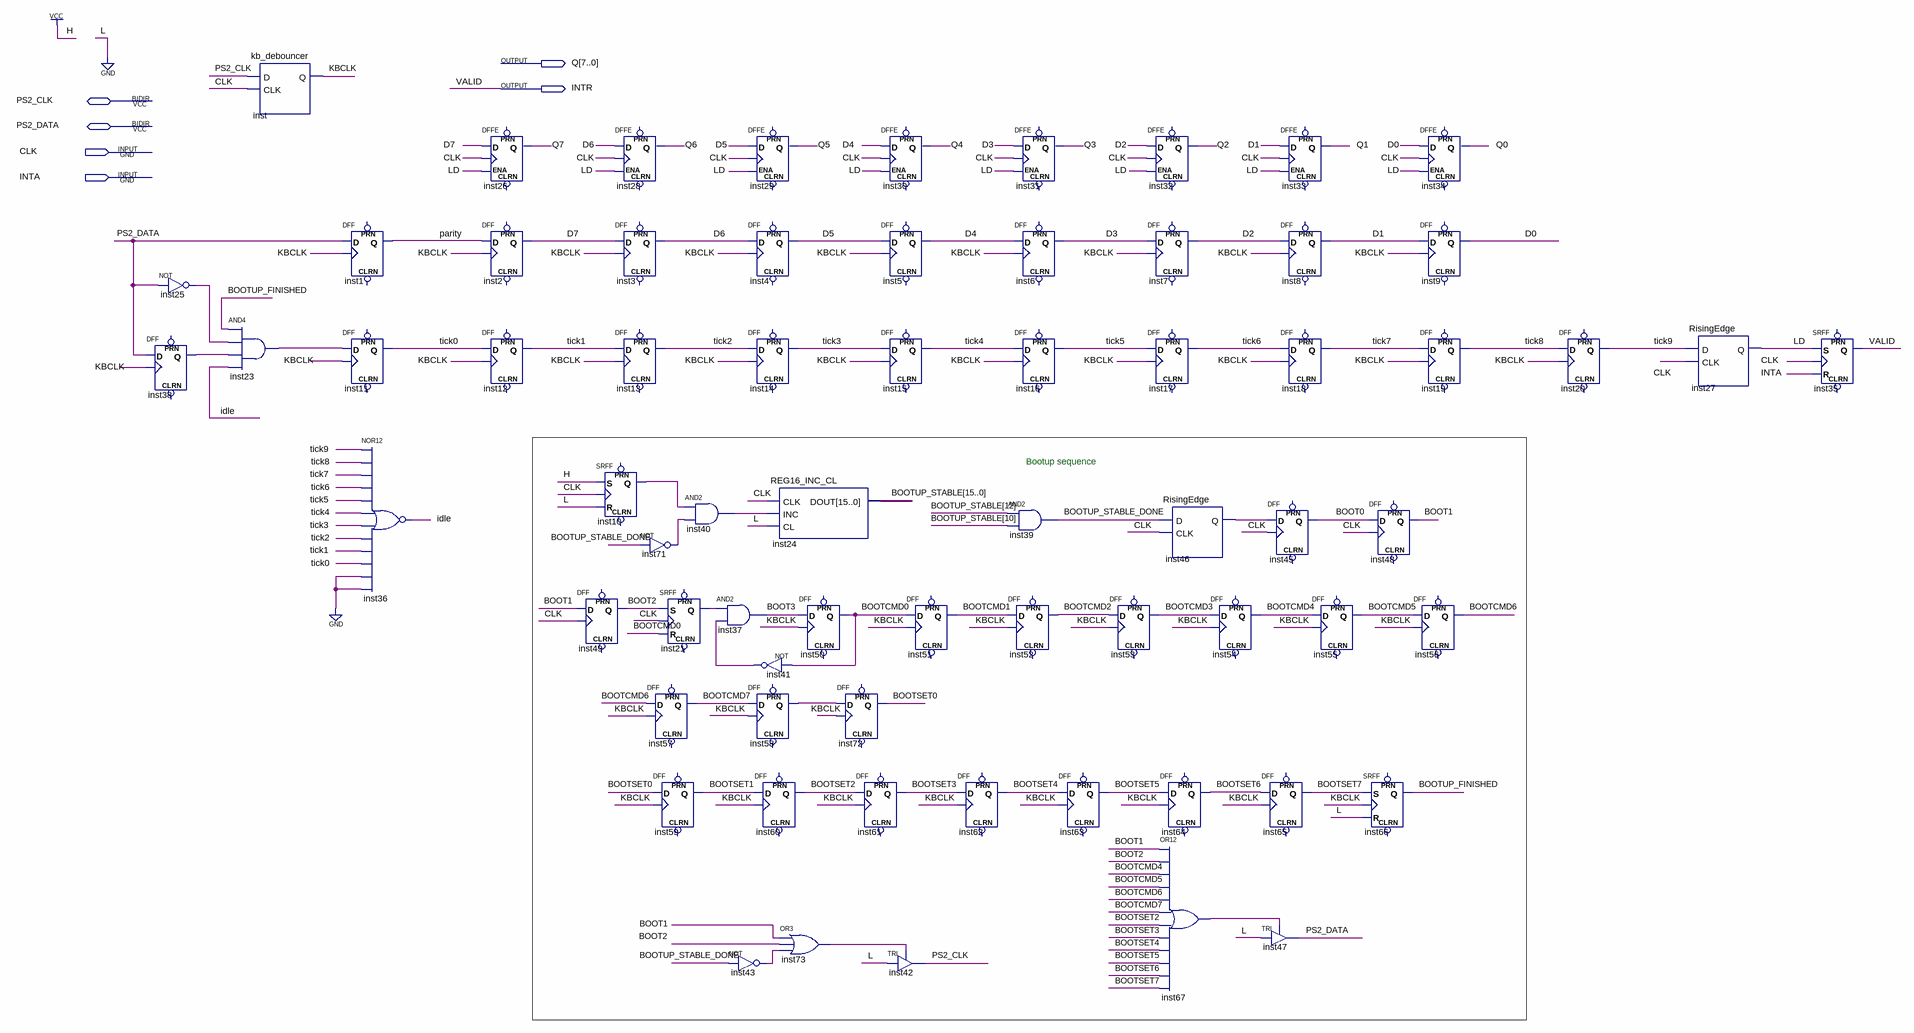
[diagram p0: schematic sheet]
// Quartus schematic kb_controller-set3-wip.bdf as structural Verilog: 69 symbols, 6 pins
module \kb_controller-set3-wip  (
  input  CLK,
  input  INTA,
  inout  PS2_CLK,
  inout  PS2_DATA,
  output [7:0] Q,
  output INTR
);

  wire BOOT0, BOOT1, BOOT2, BOOT3, BOOTCMD0, BOOTCMD1, BOOTCMD2, BOOTCMD3, BOOTCMD4, BOOTCMD5, BOOTCMD6,
       BOOTCMD7, BOOTSET0, BOOTSET1, BOOTSET2, BOOTSET3, BOOTSET4, BOOTSET5, BOOTSET6, BOOTSET7,
       BOOTUP_FINISHED, BOOTUP_STABLE_DONE, D0, D1, D2, D3, D4, D5, D6, D7, idle, inst10_q, inst21_q,
       inst23_out, inst25_out, inst38_q, inst40_out, inst41_out, inst43_out, inst46_q, inst58_q, inst67_out,
       inst71_out, inst73_out, KBCLK, LD, parity, tick0, tick1, tick2, tick3, tick4, tick5, tick6, tick7,
       tick8, tick9;
  wire [15:0] BOOTUP_STABLE;

  not inst25 (inst25_out, PS2_DATA);
  DFF inst38 (.CLK(KBCLK), .D(PS2_DATA), .Q(inst38_q));  // open: CLRN, PRN
  kb_debouncer inst (.D(PS2_CLK), .CLK(CLK), .Q(KBCLK));
  and inst23 (inst23_out, BOOTUP_FINISHED, inst25_out, inst38_q, idle);
  DFF inst1 (.CLK(KBCLK), .D(PS2_DATA), .Q(parity));  // open: CLRN, PRN
  DFF inst11 (.CLK(KBCLK), .D(inst23_out), .Q(tick0));  // open: CLRN, PRN
  nor inst36 (idle, tick9, tick8, tick7, tick6, tick5, tick4, tick3, tick2, tick1, tick0, 1'b0, 1'b0);
  DFFE inst26 (.D(D7), .CLK(CLK), .ENA(LD), .Q(Q[7]));  // open: PRN, CLRN
  DFF inst2 (.CLK(KBCLK), .D(parity), .Q(D7));  // open: CLRN, PRN
  DFF inst12 (.CLK(KBCLK), .D(tick0), .Q(tick1));  // open: CLRN, PRN
  DFF inst49 (.CLK(CLK), .D(BOOT1), .Q(BOOT2));  // open: CLRN, PRN
  DFFE inst28 (.D(D6), .CLK(CLK), .ENA(LD), .Q(Q[6]));  // open: PRN, CLRN
  DFF inst3 (.CLK(KBCLK), .D(D7), .Q(D6));  // open: CLRN, PRN
  DFF inst13 (.CLK(KBCLK), .D(tick1), .Q(tick2));  // open: CLRN, PRN
  SRFF inst10 (.S(1'b1), .R(1'b0), .CLK(CLK), .Q(inst10_q));  // open: PRN, CLRN
  not inst71 (inst71_out, BOOTUP_STABLE_DONE);
  SRFF inst21 (.S(BOOT2), .R(BOOTCMD0), .CLK(CLK), .Q(inst21_q));  // open: PRN, CLRN
  DFF inst57 (.CLK(KBCLK), .D(BOOTCMD6), .Q(BOOTCMD7));  // open: CLRN, PRN
  DFF inst59 (.CLK(KBCLK), .D(BOOTSET0), .Q(BOOTSET1));  // open: CLRN, PRN
  and inst40 (inst40_out, inst10_q, inst71_out);
  and inst37 (BOOT3, inst21_q, inst41_out);
  not inst43 (inst43_out, BOOTUP_STABLE_DONE);
  DFFE inst29 (.D(D5), .CLK(CLK), .ENA(LD), .Q(Q[5]));  // open: PRN, CLRN
  DFF inst4 (.CLK(KBCLK), .D(D6), .Q(D5));  // open: CLRN, PRN
  DFF inst14 (.CLK(KBCLK), .D(tick2), .Q(tick3));  // open: CLRN, PRN
  REG16_INC_CL inst24 (.CLK(CLK), .INC(inst40_out), .CL(1'b0), .DOUT(BOOTUP_STABLE));
  not inst41 (inst41_out, BOOTCMD0);
  DFF inst58 (.CLK(KBCLK), .D(BOOTCMD7), .Q(inst58_q));  // open: CLRN, PRN
  DFF inst60 (.CLK(KBCLK), .D(BOOTSET1), .Q(BOOTSET2));  // open: CLRN, PRN
  or inst73 (inst73_out, BOOT1, BOOT2, inst43_out);
  DFF inst50 (.CLK(KBCLK), .D(BOOT3), .Q(BOOTCMD0));  // open: CLRN, PRN
  DFFE inst30 (.D(D4), .CLK(CLK), .ENA(LD), .Q(Q[4]));  // open: PRN, CLRN
  DFF inst5 (.CLK(KBCLK), .D(D5), .Q(D4));  // open: CLRN, PRN
  DFF inst15 (.CLK(KBCLK), .D(tick3), .Q(tick4));  // open: CLRN, PRN
  DFF inst72 (.CLK(KBCLK), .D(inst58_q), .Q(BOOTSET0));  // open: CLRN, PRN
  DFF inst61 (.CLK(KBCLK), .D(BOOTSET2), .Q(BOOTSET3));  // open: CLRN, PRN
  DFF inst51 (.CLK(KBCLK), .D(BOOTCMD0), .Q(BOOTCMD1));  // open: CLRN, PRN
  TRI inst42 (.IN(1'b0), .OE(inst73_out), .OUT(PS2_CLK));
  DFF inst62 (.CLK(KBCLK), .D(BOOTSET3), .Q(BOOTSET4));  // open: CLRN, PRN
  DFFE inst31 (.D(D3), .CLK(CLK), .ENA(LD), .Q(Q[3]));  // open: PRN, CLRN
  DFF inst6 (.CLK(KBCLK), .D(D4), .Q(D3));  // open: CLRN, PRN
  DFF inst16 (.CLK(KBCLK), .D(tick4), .Q(tick5));  // open: CLRN, PRN
  and inst39 (BOOTUP_STABLE_DONE, BOOTUP_STABLE[12], BOOTUP_STABLE[10]);
  DFF inst52 (.CLK(KBCLK), .D(BOOTCMD1), .Q(BOOTCMD2));  // open: CLRN, PRN
  DFF inst63 (.CLK(KBCLK), .D(BOOTSET4), .Q(BOOTSET5));  // open: CLRN, PRN
  DFF inst53 (.CLK(KBCLK), .D(BOOTCMD2), .Q(BOOTCMD3));  // open: CLRN, PRN
  DFFE inst32 (.D(D2), .CLK(CLK), .ENA(LD), .Q(Q[2]));  // open: PRN, CLRN
  DFF inst7 (.CLK(KBCLK), .D(D3), .Q(D2));  // open: CLRN, PRN
  DFF inst17 (.CLK(KBCLK), .D(tick5), .Q(tick6));  // open: CLRN, PRN
  RisingEdge inst46 (.D(BOOTUP_STABLE_DONE), .CLK(CLK), .Q(inst46_q));
  DFF inst64 (.CLK(KBCLK), .D(BOOTSET5), .Q(BOOTSET6));  // open: CLRN, PRN
  or inst67 (inst67_out, BOOT1, BOOT2, BOOTCMD4, BOOTCMD5, BOOTCMD6, BOOTCMD7, BOOTSET2, BOOTSET3, BOOTSET4, BOOTSET5, BOOTSET6, BOOTSET7);
  DFF inst54 (.CLK(KBCLK), .D(BOOTCMD3), .Q(BOOTCMD4));  // open: CLRN, PRN
  DFFE inst33 (.D(D1), .CLK(CLK), .ENA(LD), .Q(Q[1]));  // open: PRN, CLRN
  DFF inst8 (.CLK(KBCLK), .D(D2), .Q(D1));  // open: CLRN, PRN
  DFF inst18 (.CLK(KBCLK), .D(tick6), .Q(tick7));  // open: CLRN, PRN
  DFF inst45 (.CLK(CLK), .D(inst46_q), .Q(BOOT0));  // open: CLRN, PRN
  DFF inst65 (.CLK(KBCLK), .D(BOOTSET6), .Q(BOOTSET7));  // open: CLRN, PRN
  TRI inst47 (.IN(1'b0), .OE(inst67_out), .OUT(PS2_DATA));
  DFF inst55 (.CLK(KBCLK), .D(BOOTCMD4), .Q(BOOTCMD5));  // open: CLRN, PRN
  DFF inst48 (.CLK(CLK), .D(BOOT0), .Q(BOOT1));  // open: CLRN, PRN
  SRFF inst66 (.S(BOOTSET7), .R(1'b0), .CLK(KBCLK), .Q(BOOTUP_FINISHED));  // open: PRN, CLRN
  DFFE inst34 (.D(D0), .CLK(CLK), .ENA(LD), .Q(Q[0]));  // open: PRN, CLRN
  DFF inst9 (.CLK(KBCLK), .D(D1), .Q(D0));  // open: CLRN, PRN
  DFF inst19 (.CLK(KBCLK), .D(tick7), .Q(tick8));  // open: CLRN, PRN
  DFF inst56 (.CLK(KBCLK), .D(BOOTCMD5), .Q(BOOTCMD6));  // open: CLRN, PRN
  DFF inst20 (.CLK(KBCLK), .D(tick8), .Q(tick9));  // open: CLRN, PRN
  RisingEdge inst27 (.D(tick9), .CLK(CLK), .Q(LD));
  SRFF inst35 (.S(LD), .R(INTA), .CLK(CLK), .Q(INTR));  // open: PRN, CLRN

  // Other names for the same wires on the sheet: VALID = INTR

  // Notes on the sheet:
  //   Bootup sequence
endmodule
